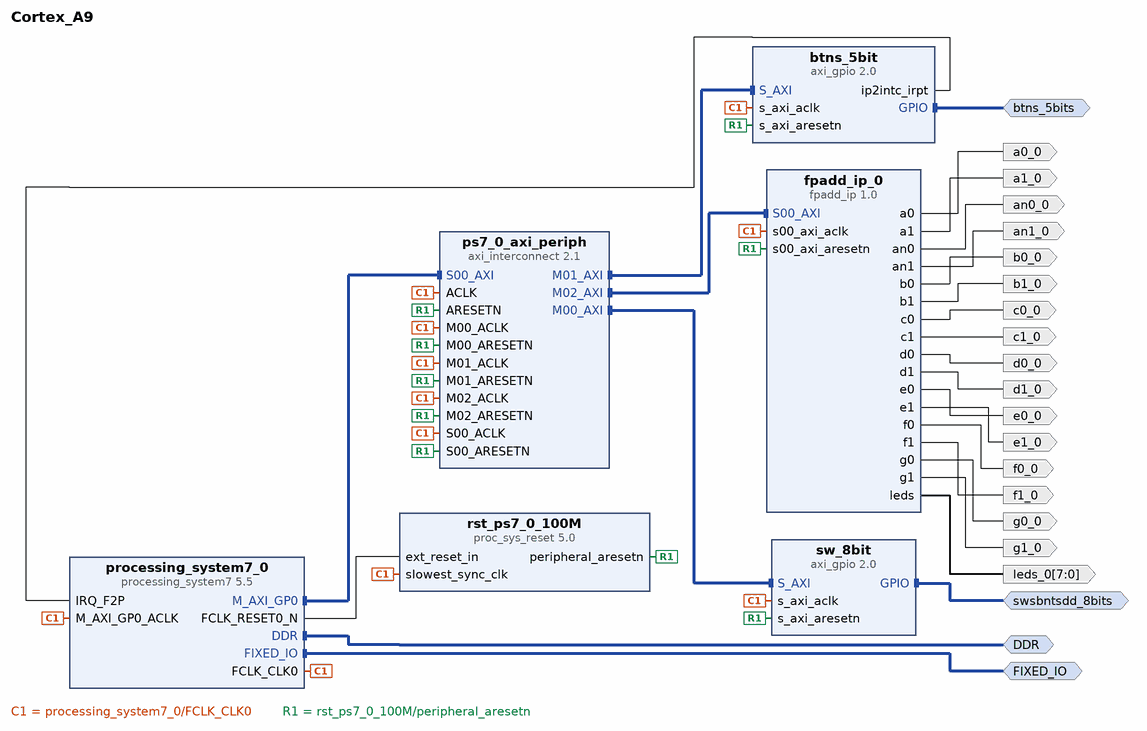
[diagram p0: block diagram of the top level]
# Vivado block design Cortex_A9, xc7z020clg484-1, Vivado 2020.2
create_bd_design Cortex_A9

create_bd_intf_port -mode Master -vlnv xilinx.com:interface:ddrx_rtl:1.0 DDR
create_bd_intf_port -mode Master -vlnv xilinx.com:display_processing_system7:fixedio_rtl:1.0 FIXED_IO
create_bd_intf_port -mode Master -vlnv xilinx.com:interface:gpio_rtl:1.0 swsbntsdd_8bits
create_bd_intf_port -mode Master -vlnv xilinx.com:interface:gpio_rtl:1.0 btns_5bits
create_bd_port -dir O -from 7 -to 0 leds_0
create_bd_port -dir O an0_0
create_bd_port -dir O a0_0
create_bd_port -dir O b0_0
create_bd_port -dir O c0_0
create_bd_port -dir O d0_0
create_bd_port -dir O e0_0
create_bd_port -dir O f0_0
create_bd_port -dir O g0_0
create_bd_port -dir O an1_0
create_bd_port -dir O a1_0
create_bd_port -dir O b1_0
create_bd_port -dir O c1_0
create_bd_port -dir O d1_0
create_bd_port -dir O e1_0
create_bd_port -dir O f1_0
create_bd_port -dir O g1_0

create_bd_cell -type ip -vlnv xilinx.com:ip:processing_system7:5.5 processing_system7_0
set_property -dict [list \
  CONFIG.PCW_APU_PERIPHERAL_FREQMHZ 666.666667 \
  CONFIG.PCW_ENET0_PERIPHERAL_ENABLE 0 \
  CONFIG.PCW_FPGA0_PERIPHERAL_FREQMHZ 100.000000 \
  CONFIG.PCW_FPGA1_PERIPHERAL_FREQMHZ 150.000000 \
  CONFIG.PCW_GPIO_MIO_GPIO_ENABLE 0 \
  CONFIG.PCW_IRQ_F2P_INTR 1 \
  CONFIG.PCW_PRESET_BANK1_VOLTAGE {LVCMOS 1.8V} \
  CONFIG.PCW_QSPI_PERIPHERAL_ENABLE 0 \
  CONFIG.PCW_SD0_PERIPHERAL_ENABLE 0 \
  CONFIG.PCW_UART1_PERIPHERAL_ENABLE 1 \
  CONFIG.PCW_UART1_UART1_IO {MIO 48 .. 49} \
  CONFIG.PCW_UART_PERIPHERAL_FREQMHZ 50 \
  CONFIG.PCW_UIPARAM_DDR_FREQ_MHZ 533.333313 \
  CONFIG.PCW_UIPARAM_DDR_PARTNO {MT41J128M16 HA-15E} \
  CONFIG.PCW_USB0_PERIPHERAL_ENABLE 0 \
  CONFIG.PCW_USE_FABRIC_INTERRUPT 1 \
  CONFIG.preset ZedBoard \
] [get_bd_cells processing_system7_0]
# 70 more settings of processing_system7_0 are not shown: defaults, MIO pin electricals, DDR timing, and values the tool derives
create_bd_cell -type ip -vlnv xilinx.com:ip:axi_gpio:2.0 sw_8bit
set_property -dict {CONFIG.GPIO_BOARD_INTERFACE sws_8bits CONFIG.USE_BOARD_FLOW true} [get_bd_cells sw_8bit]
create_bd_cell -type ip -vlnv xilinx.com:ip:axi_interconnect:2.1 ps7_0_axi_periph
set_property -dict {CONFIG.NUM_MI 3} [get_bd_cells ps7_0_axi_periph]
create_bd_cell -type ip -vlnv xilinx.com:ip:proc_sys_reset:5.0 rst_ps7_0_100M
create_bd_cell -type ip -vlnv xilinx.com:ip:axi_gpio:2.0 btns_5bit
set_property -dict [list \
  CONFIG.C_INTERRUPT_PRESENT 1 \
  CONFIG.GPIO_BOARD_INTERFACE btns_5bits \
  CONFIG.USE_BOARD_FLOW true \
] [get_bd_cells btns_5bit]
create_bd_cell -type ip -vlnv xilinx.com:user:fpadd_ip:1.0 fpadd_ip_0

# ---- connections ----

connect_bd_intf_net [get_bd_intf_pins ps7_0_axi_periph/M02_AXI] [get_bd_intf_pins fpadd_ip_0/S00_AXI]
connect_bd_intf_net -intf_net axi_gpio_0_GPIO [get_bd_intf_ports swsbntsdd_8bits] [get_bd_intf_pins sw_8bit/GPIO]
connect_bd_intf_net [get_bd_intf_pins processing_system7_0/M_AXI_GP0] [get_bd_intf_pins ps7_0_axi_periph/S00_AXI]
connect_bd_intf_net [get_bd_intf_pins btns_5bit/S_AXI] [get_bd_intf_pins ps7_0_axi_periph/M01_AXI]
connect_bd_intf_net [get_bd_intf_ports btns_5bits] [get_bd_intf_pins btns_5bit/GPIO]
connect_bd_intf_net [get_bd_intf_pins ps7_0_axi_periph/M00_AXI] [get_bd_intf_pins sw_8bit/S_AXI]
connect_bd_intf_net [get_bd_intf_ports DDR] [get_bd_intf_pins processing_system7_0/DDR]
connect_bd_intf_net [get_bd_intf_ports FIXED_IO] [get_bd_intf_pins processing_system7_0/FIXED_IO]
connect_bd_net [get_bd_pins processing_system7_0/FCLK_CLK0] \
  [get_bd_pins processing_system7_0/M_AXI_GP0_ACLK] [get_bd_pins ps7_0_axi_periph/S00_ACLK] \
  [get_bd_pins rst_ps7_0_100M/slowest_sync_clk] [get_bd_pins sw_8bit/s_axi_aclk] [get_bd_pins ps7_0_axi_periph/M00_ACLK] \
  [get_bd_pins ps7_0_axi_periph/ACLK] [get_bd_pins btns_5bit/s_axi_aclk] [get_bd_pins ps7_0_axi_periph/M01_ACLK] \
  [get_bd_pins ps7_0_axi_periph/M02_ACLK] [get_bd_pins fpadd_ip_0/s00_axi_aclk]
connect_bd_net [get_bd_pins processing_system7_0/FCLK_RESET0_N] [get_bd_pins rst_ps7_0_100M/ext_reset_in]
connect_bd_net [get_bd_pins rst_ps7_0_100M/peripheral_aresetn] \
  [get_bd_pins ps7_0_axi_periph/S00_ARESETN] [get_bd_pins sw_8bit/s_axi_aresetn] [get_bd_pins ps7_0_axi_periph/M00_ARESETN] \
  [get_bd_pins ps7_0_axi_periph/ARESETN] [get_bd_pins btns_5bit/s_axi_aresetn] [get_bd_pins ps7_0_axi_periph/M01_ARESETN] \
  [get_bd_pins ps7_0_axi_periph/M02_ARESETN] [get_bd_pins fpadd_ip_0/s00_axi_aresetn]
connect_bd_net [get_bd_pins btns_5bit/ip2intc_irpt] [get_bd_pins processing_system7_0/IRQ_F2P]
connect_bd_net [get_bd_pins fpadd_ip_0/leds] [get_bd_ports leds_0]
connect_bd_net [get_bd_pins fpadd_ip_0/an0] [get_bd_ports an0_0]
connect_bd_net [get_bd_pins fpadd_ip_0/a0] [get_bd_ports a0_0]
connect_bd_net [get_bd_pins fpadd_ip_0/b0] [get_bd_ports b0_0]
connect_bd_net [get_bd_pins fpadd_ip_0/c0] [get_bd_ports c0_0]
connect_bd_net [get_bd_pins fpadd_ip_0/d0] [get_bd_ports d0_0]
connect_bd_net [get_bd_pins fpadd_ip_0/e0] [get_bd_ports e0_0]
connect_bd_net [get_bd_pins fpadd_ip_0/f0] [get_bd_ports f0_0]
connect_bd_net [get_bd_pins fpadd_ip_0/g0] [get_bd_ports g0_0]
connect_bd_net [get_bd_pins fpadd_ip_0/an1] [get_bd_ports an1_0]
connect_bd_net [get_bd_pins fpadd_ip_0/a1] [get_bd_ports a1_0]
connect_bd_net [get_bd_pins fpadd_ip_0/b1] [get_bd_ports b1_0]
connect_bd_net [get_bd_pins fpadd_ip_0/c1] [get_bd_ports c1_0]
connect_bd_net [get_bd_pins fpadd_ip_0/d1] [get_bd_ports d1_0]
connect_bd_net [get_bd_pins fpadd_ip_0/e1] [get_bd_ports e1_0]
connect_bd_net [get_bd_pins fpadd_ip_0/f1] [get_bd_ports f1_0]
connect_bd_net [get_bd_pins fpadd_ip_0/g1] [get_bd_ports g1_0]

# ---- address map ----
assign_bd_address -offset 0x41200000 -range 64K -target_address_space [get_bd_addr_spaces processing_system7_0/Data] [get_bd_addr_segs sw_8bit/S_AXI/Reg]
assign_bd_address -offset 0x41210000 -range 64K -target_address_space [get_bd_addr_spaces processing_system7_0/Data] [get_bd_addr_segs btns_5bit/S_AXI/Reg]
assign_bd_address -offset 0x41220000 -range 64K -target_address_space [get_bd_addr_spaces processing_system7_0/Data] [get_bd_addr_segs fpadd_ip_0/S00_AXI/S00_AXI_reg]

validate_bd_design
save_bd_design
